# EAGLE design Tapuino 1.2 con botones (EAGLE 7.1.0)
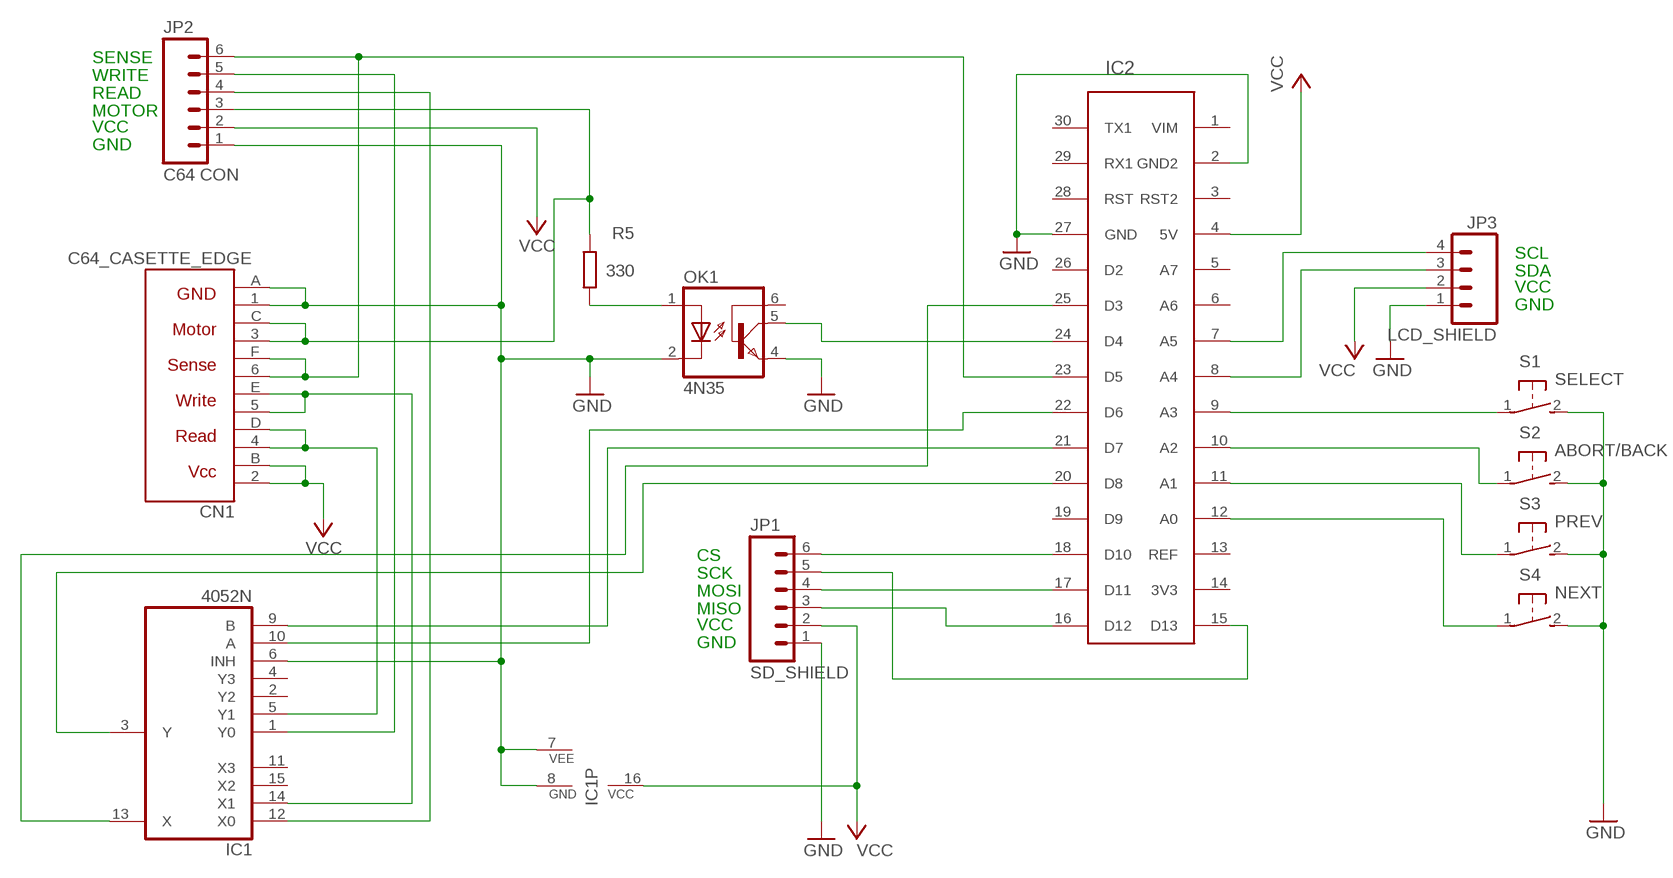
[diagram p0: schematic, sheet 1]

## Parts
CN1  C64_CASETTE_EDGE  [C64_CASSETTE]
IC1  4052N  [DIL16]
IC2  ARDUINO_NANO_V3  [NANO_V3]
JP1  SD_SHIELD  M06LOCK_LONGPADS  [1X06_LOCK_LONGPADS]
JP2  C64 CON  M06LOCK_LONGPADS  [1X06_LOCK_LONGPADS]
JP3  LCD_SHIELD  M04LOCK_LONGPADS  [1X04_LOCK_LONGPADS]
OK1  4N35  [DIL06]
R5  330  R-EU_0207/10  [0207/10]
S1  SELECT  31-XX  [B3F-31XX]
S2  ABORT/BACK  31-XX  [B3F-31XX]
S3  PREV  31-XX  [B3F-31XX]
S4  NEXT  31-XX  [B3F-31XX]

## Nets
GND [GND]: CN1.1(GND1) CN1.A(GND2) IC1.6(INH) IC1.7(VEE) IC1.8(GND) IC2.2(GND2) IC2.27(GND) JP1.1 JP2.1 JP3.1 OK1.2(C) OK1.4(EMI) S1.2(S) S2.2(S) S3.2(S) S4.2(S)
N$1: IC2.16(D12) JP1.3
N$2: IC2.18(D10) JP1.6
N$3: IC2.15(D13) JP1.5
N$4: IC2.17(D11) JP1.4
N$5: IC2.7(A5) JP3.4
N$6: IC2.8(A4) JP3.3
N$7: IC2.9(A3) S1.1(P)
N$8: OK1.1(A) R5.1
N$9: IC2.12(A0) S4.1(P)
N$10: IC2.24(D4) OK1.5(COL)
N$11: IC2.11(A1) S3.1(P)
N$13: IC1.1(Y0) JP2.5
N$14: CN1.3(MOTOR1) CN1.C(MOTOR2) JP2.3 R5.2
N$15: IC1.3(Y) IC2.20(D8)
N$16: IC1.12(X0) JP2.4
N$17: CN1.6(SENSE1) CN1.F(SENSE2) IC2.23(D5) JP2.6
N$18: IC1.13(X) IC2.25(D3)
N$19: CN1.4(READ1) CN1.D(READ2) IC1.5(Y1)
N$20: IC1.9(B) IC2.21(D7)
N$21: CN1.5(WRITE1) CN1.E(WRITE2) IC1.14(X1)
N$22: IC1.10(A) IC2.22(D6)
N$23: IC2.10(A2) S2.1(P)
VCC [VCC]: CN1.2(VCC1) CN1.B(VCC2) IC1.16(VCC) IC2.4(5V) JP1.2 JP2.2 JP3.2
Unconnected: IC1.2(Y2) IC1.4(Y3) IC1.11(X3) IC1.15(X2) IC2.1(VIM) IC2.3(RST2) IC2.5(A7) IC2.6(A6) IC2.13(REF) IC2.14(3V3) IC2.19(D9) IC2.26(D2) IC2.28(RST) IC2.29(RX1) IC2.30(TX1) OK1.6(BAS)

## Notes on the sheet
- SENSE
- WRITE
- READ
- MOTOR
- VCC
- GND
- SCL
- SDA
- VCC
- GND
- CS
- SCK
- MOSI
- MISO
- VCC
- GND

## Library data of the parts
CN1 = commodore MOD:C64_CASETTE_EDGE
IC1 = 40xx:4052: Dual 4-channel ANALOG MULTIPLEXER
IC2 = arduino:ARDUINO_NANO_V3
JP1 JP2 = SparkFun:M06: Header 6 Standard 6-pin 0.1" header. Use with straight break away headers (SKU : PRT-00116), right angle break away headers (PRT-00553), swiss pins (PRT-00743), machine pins (PRT-00117), and female headers (PRT-00115). Molex polarized connector foot print use with SKU : PRT-08094 with associated crimp pins and housings. NOTES ON THE VARIANTS LOCK and LOCK_LONGPADS... This footprint was designed to help hold the alignment of a through-hole component (i.e. 6-pin header) while soldering it into place. You may notice that each hole has been shifted either up or down by 0.005 of an inch from it's more standard position (which is a perfectly straight line). This slight alteration caused the pins (the squares in the middle) to touch the edges of the holes. Because they are alternating, it causes a "brace" to hold the component in place. 0.005 has proven to be the perfect amount of "off-center" position when using our standard breakaway headers. Although looks a little odd when you look at the bare footprint, once you have a header in there, the alteration is very hard to notice. Also, if you push a header all the way into place, it is covered up entirely on the bottom side. This idea of altering the position of holes to aid alignment will be further integrated into the Sparkfun Library for other footprints. It can help hold any component with 3 or more connection pins.
JP3 = SparkFun:M04: Header 4 Standard 4-pin 0.1" header. Use with straight break away headers (SKU : PRT-00116), right angle break away headers (PRT-00553), swiss pins (PRT-00743), machine pins (PRT-00117), and female headers (PRT-00115). Molex polarized connector foot print use with SKU : PRT-08231 with associated crimp pins and housings.
OK1 = optocoupler:4N35: MOTOROLA OPTO COUPLER; MF: FAIRCHILD SEMICONDUCTOR; MPN: 4N35; OC_FARNELL: 1328375; OC_NEWARK: 72K9946
R5 = resistor:R-EU_: RESISTOR, European symbol
S1-S4 = switch-omron:31-XX: OMRON SWITCH; MPN: B3F-3100; OC_FARNELL: 959704; OC_NEWARK: 36M3582

## Net classes
0 default: width 0.254 mm, clearance 0.254 mm
1 GND: width 0.762 mm, clearance 0.381 mm
2 VCC: width 0.762 mm, clearance 0.381 mm

## Board
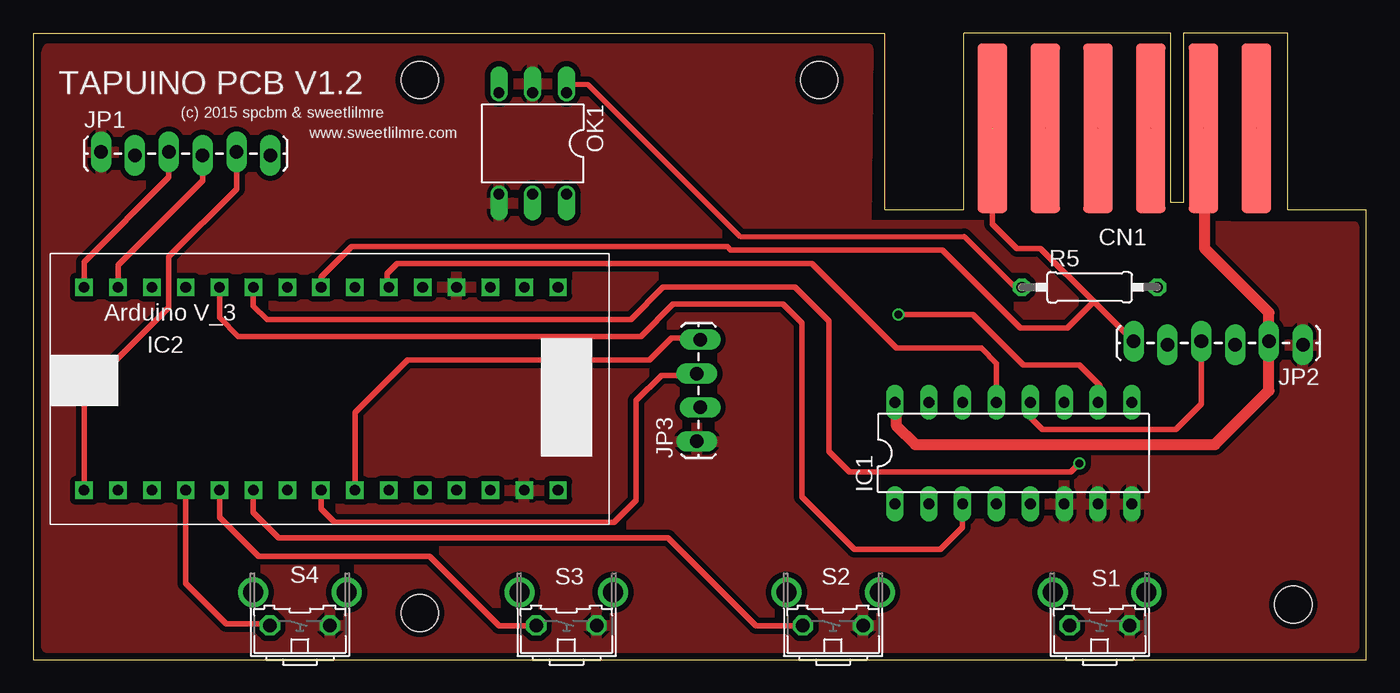
[diagram p1: board, top side]
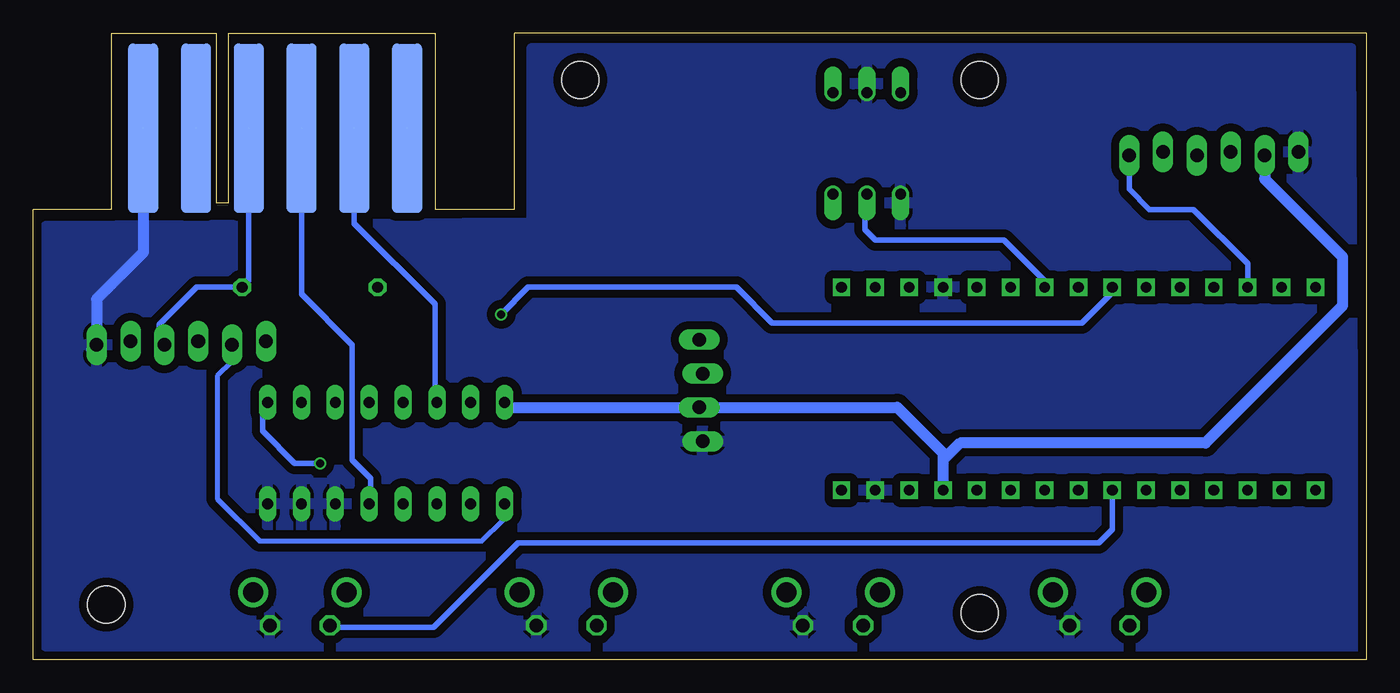
[diagram p2: board, bottom side, seen from below]

Size 100 x 47 mm. Coordinates in mm from the lower left corner, seen from the top.
Outline: 94.11,33.78 100,33.78 100,0 0,0 0,47 63.9,47
Outline: 69.77,33.78 63.88,33.78 63.88,47
Copper layers (1*16): Top 0.035mm / dielectric 1.5mm / Bottom 0.035mm
Design rules "ITEADstudio_DRC": minimum track width 6mil, minimum drill 12mil, track to track 6mil, track to pad 6mil, pad to pad 6mil, via to via 6mil, smd to smd 0mil, copper to edge 10mil, drill to drill 10mil, minimum pad ring 10mil, minimum via ring 6mil, stop-mask expansion 2mil, vias tented up to drill 100mil, thermal gap 10mil
Holes 2.8 mm at 29,43.5 29,3.5 94.53,4.13 58.97,43.5

### Footprints (pad centres in the part's own frame; a part is rotated, then mirrored left to right if it is on the bottom)
C64_CASSETTE = smd 2.2 x 12.7: 1 -21.779,-0.5; 2 -17.819,-0.5; 3 -13.859,-0.5; 4 -9.899,-0.5; 5 -5.939,-0.5; 6 -1.979,-0.5 | smd 2.2 x 12.7 bottom: A -21.779,-0.5; B -17.819,-0.5; C -13.859,-0.5; D -9.899,-0.5; E -5.939,-0.5; F -1.979,-0.5
DIL16 = drill 0.813 long: 1 -8.89,-3.81; 2 -6.35,-3.81; 3 -3.81,-3.81; 4 -1.27,-3.81; 5 1.27,-3.81; 6 3.81,-3.81; 7 6.35,-3.81; 8 8.89,-3.81; 9 8.89,3.81; 10 6.35,3.81; 11 3.81,3.81; 12 1.27,3.81; 13 -1.27,3.81; 14 -3.81,3.81; 15 -6.35,3.81; 16 -8.89,3.81
NANO_V3 = drill 0.8 square: 1 -7.62,1.27; 2 -5.08,1.27; 3 -2.54,1.27; 4 0,1.27; 5 2.54,1.27; 6 5.08,1.27; 7 7.62,1.27; 8 10.16,1.27; 9 12.7,1.27; 10 15.24,1.27; 11 17.78,1.27; 12 20.32,1.27; 13 22.86,1.27; 14 25.4,1.27; 15 27.94,1.27; 16 27.94,-13.97; 17 25.4,-13.97; 18 22.86,-13.97; 19 20.32,-13.97; 20 17.78,-13.97; 21 15.24,-13.97; 22 12.7,-13.97; 23 10.16,-13.97; 24 7.62,-13.97; 25 5.08,-13.97; 26 2.54,-13.97; 27 0,-13.97; 28 -2.54,-13.97; 29 -5.08,-13.97; 30 -7.62,-13.97
1X06_LOCK_LONGPADS = drill 1.016 long: 1 0,0; 2 2.54,-0.254; 3 5.08,0; 4 7.62,-0.254; 5 10.16,0; 6 12.7,-0.254
1X04_LOCK_LONGPADS = drill 1.016 long: 1 0,0; 2 2.54,-0.254; 3 5.08,0; 4 7.62,-0.254
DIL06 = drill 0.813 offset: 1 -2.54,-3.81; 2 0,-3.81; 3 2.54,-3.81; 4 2.54,3.81; 5 0,3.81; 6 -2.54,3.81
0207/10 = drill 0.813 octagon: 1 -5.08,0; 2 5.08,0
B3F-31XX = drill 1.016 octagon: 1 -2.261,-1.245; 2 2.261,-1.245 | drill 1.499 pad 2.159: 3 -3.505,1.245; 4 3.505,1.245

### Placement (x,y rotation side)
CN1  69.98,39.37 180 top
IC1  73.53,15.49 0 top
IC2  31.75,13.97 180 top
JP1  5.08,38.1 0 top
JP2  95.25,23.62 180 top
JP3  49.78,16.38 90 top
OK1  37.47,38.73 180 top
R5  79.25,27.94 0 top
S1  80,3.81 0 top
S2  60,3.81 0 top
S3  40,3.81 0 top
S4  20,3.81 0 top

### Tracks (layer width: path | path; a pad name or v marks a point on that pad's centre or on a via)
GND  (1 unrouted)
  Bottom 0.813: CN1.A 91.76,30.55 95.25,27.05 JP2.1 95.63,23.24
  pour Bottom (isolate 0.61): 1.14,45.85 62.61,45.85 62.61,32.77 99.06,32.51 99.06,1.02 0.89,0.76
  pour Top (isolate 0.406): 1.14,45.85 62.61,45.85 62.48,32.64 98.93,32.51 99.06,32.51 99.06,0.89 1.02,0.89 1.02,45.59
N$1
  Top 0.381: JP1.3 10.16,36.99
  Top 0.406: IC2.16 3.81,29.84 10.16,36.2 JP1.3
N$2
  Bottom 0.406: IC2.18 8.89,29.72 12.95,33.78 16.26,33.78 17.78,35.31 JP1.6
N$3
  Top 0.406: IC2.15 3.81,20.07 10.16,26.42 10.16,30.23 15.24,35.31 JP1.5
N$4
  Top 0.406: IC2.17 6.35,29.59 12.7,35.94 JP1.4
N$5
  Top 0.406: IC2.7 24.13,18.54 28.07,22.48 46.23,22.48 47.88,24.13 49.91,24.13 JP3.4
N$6
  Top 0.406: IC2.8 21.59,11.3 22.61,10.29 43.56,10.29 45.21,11.94 45.21,19.43 47.12,21.34 49.66,21.34 JP3.3
N$7
  Bottom 0.406: IC2.9 19.05,9.78 20.07,8.76 63.63,8.76 69.98,2.41 77.59,2.41 S1.1
N$8
  Top 0.381: R5.1 73.66,27.94 69.85,31.75 53.02,31.75 41.59,43.18 40.48,43.18 40.01,42.7 OK1.1
N$9
  Top 0.406: IC2.12 11.43,5.71 14.48,2.67 17.64,2.67 S4.1
N$10
  Bottom 0.406: IC2.24 24.13,28.45 27.18,31.5 36.83,31.5 37.59,32.26 37.59,34.8 OK1.5
N$11
  Top 0.406: IC2.11 13.97,10.67 16.89,7.75 29.72,7.75 34.92,2.54 37.71,2.54 S3.1
N$13
  Bottom 0.381: JP2.5 85.09,22.38 86.2,21.27 86.2,12.06 83.03,8.89 66.36,8.89 64.77,10.48 64.77,11.59 IC1.1
N$14  (1 unrouted)
  Bottom 0.406: CN1.C 83.84,28.43 R5.2 87.76,27.94 90.55,25.15 90.55,24 JP2.3
N$15
  Top 0.406: IC1.3 69.72,9.91 68.07,8.26 61.59,8.26 57.66,12.19 57.66,25.27 56.26,26.67 48.01,26.67 45.59,24.26 15.37,24.26 13.97,25.65 IC2.20
N$16
  Top 0.406: IC1.12 74.8,18.16 75.69,17.27 85.72,17.27 87.63,19.18 JP2.4
N$17  (1 unrouted)
  Top 0.406: CN1.F 71.96,32.69 73.79,30.86 75.56,30.86 79.57,26.86 | 79.57,26.86 JP2.6 | IC2.23 21.59,28.7 23.88,30.99 52.07,30.99 52.32,30.73 68.2,30.73 74.04,24.89 77.6,24.89 79.57,26.86
N$18
  Top 0.406: IC1.13 72.26,22.23 71.12,23.37 64.77,23.37 58.42,29.72 27.3,29.72 26.54,28.96 26.54,28.07 IC2.25
N$19  (1 unrouted)
  Bottom 0.406: CN1.D 79.88,27.43 76.07,23.62 76.07,14.99 74.68,13.59 74.68,11.81 IC1.5
N$20  (via drill 0.6)
  Top 0.406: IC2.21 16.51,26.54 17.53,25.53 44.83,25.53 47.24,27.94 57.15,27.94 59.69,25.4 59.69,15.62 61.21,14.1 77.85,14.1 v78.49,14.73
  Bottom 0.406: v78.49,14.73 80.39,14.73 82.8,17.14 82.8,18.92 IC1.9
N$21  (1 unrouted)
  Bottom 0.406: CN1.5 75.92,32.74 69.85,26.67 69.85,19.43 IC1.14
N$22  (via drill 0.6)
  Top 0.406: v64.9,25.91 70.48,25.91 74.3,22.1 78.49,22.1 80.01,20.57 80.01,19.43 IC1.10
  Bottom 0.406: IC2.22 19.05,27.56 21.34,25.27 44.58,25.27 47.24,27.94 62.87,27.94 v64.9,25.91
N$23
  Top 0.406: IC2.10 16.51,11.05 18.41,9.14 47.62,9.14 54.23,2.54 57.71,2.54 S2.1
VCC  (1 unrouted)
  Top 0.813: CN1.2 87.88,35.6 87.88,30.86 92.71,26.04 JP2.2 92.71,20.19 88.65,16.13 66.17,16.13 64.77,17.53 64.77,19.18 IC1.16
  Bottom 0.762: 50.16,18.89 JP3.2 | 7.62,36.67 JP1.2
  Bottom 0.813: 7.62,36.67 7.62,36.07 1.78,30.23 1.78,26.54 12.06,16.26 30.48,16.26 31.75,14.99 | JP3.2 35.18,18.92 31.75,15.49 31.75,14.99 | 31.75,14.99 IC2.4 | 50.16,18.89 64.64,18.89 IC1.16

### Text on the board
tNames: TAPUINO PCB V1.2 | (c) 2015 spcbm & sweetlilmre | www.sweetlilmre.com